# Altium schematic sheet Sheet1.SchDoc
size A
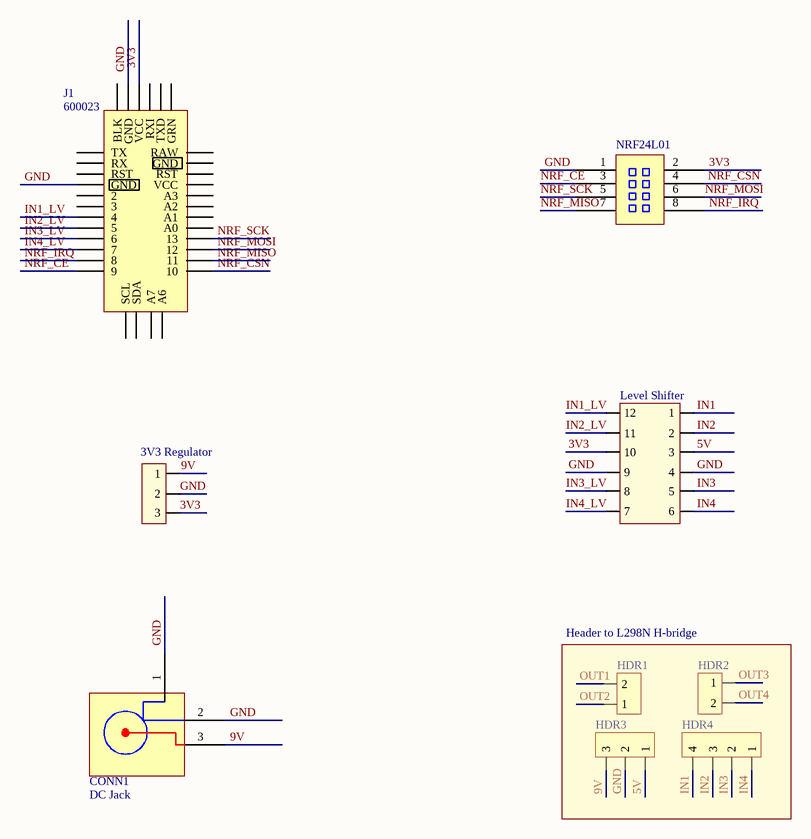
[diagram p0: Sheet1.SchDoc]

## Parts
3V3_Regulator  3-Pos  [Header3 - SIMPLE]  (value not drawn)
CONN1  DC Jack  [DC Jack]
HDR1  2-Pos  [Header2 - SIMPLE]  (value not drawn)
HDR2  2-Pos  [Header2 - SIMPLE]  (value not drawn)
HDR3  3-Pos  [Header3 - SIMPLE]  (value not drawn)
HDR4  4-Pos  [Header4-simple]  (value not drawn)
J1  600023  [Arduino Pro Mini]
Level_Shifter  12-Pos  [Module-level shifter]  (value not drawn)
NRF24L01  ESP01, NRF2401 Modules  [Header8]  (value not drawn)

## Blocks framed on the sheet
Header to L298N H-bridge: HDR1-HDR4

## Nets
3V3: 3V3_Regulator.3 J1.2(VCC) Level_Shifter.10 NRF24L01.2
5V: HDR3.1 Level_Shifter.3
9V: 3V3_Regulator.1 CONN1.3 HDR3.3
GND: 3V3_Regulator.2 CONN1.1 CONN1.2 HDR3.2 J1.1(GND) J1.10(GND) Level_Shifter.4 Level_Shifter.9 NRF24L01.1
IN1: HDR4.4 Level_Shifter.1
IN1_LV: J1.13(4) Level_Shifter.12
IN2: HDR4.3 Level_Shifter.2
IN2_LV: J1.14(5) Level_Shifter.11
IN3: HDR4.2 Level_Shifter.5
IN3_LV: J1.15(6) Level_Shifter.8
IN4: HDR4.1 Level_Shifter.6
IN4_LV: J1.16(7) Level_Shifter.7
NRF_CE: J1.18(9) NRF24L01.3
NRF_CSN: J1.19(10) NRF24L01.4
NRF_IRQ: J1.17(8) NRF24L01.8
NRF_MISO: J1.20(11) NRF24L01.7
NRF_MOSI: J1.21(12) NRF24L01.6
NRF_SCK: J1.22(13) NRF24L01.5
OUT1: HDR1.2
OUT2: HDR1.1
OUT3: HDR2.1
OUT4: HDR2.2

Not connected (* = marked no-connect by the designer): J1 0(BLK) 3(RXI) 4(TXD) 5(GRN) 7(TX) 8(RX) 9(RST) 11(2) 12(3) 23(A0) 24(A1) 25(A2) 26(A3) 27(VCC) 28(RST) 29(GND) 30(RAW) 31(SCL) 32(SDA) 36(A7) 37(A6)

## Library data of the parts
3V3_Regulator HDR3 = 600032: HDR, Female 3-position
CONN1 = 600035: CONN, 6mm Hole Size DC Jack
HDR1 HDR2 = 600034: HDR, Female, 2-position
HDR4 = 600031: HDR, Female 4-position
J1 = 600023: CONN, 24-Pos, for Arduino Pro Mini
Level_Shifter = 600048: Module, level-shifter
NRF24L01 = 600030: Module, Female HDR 8-Position